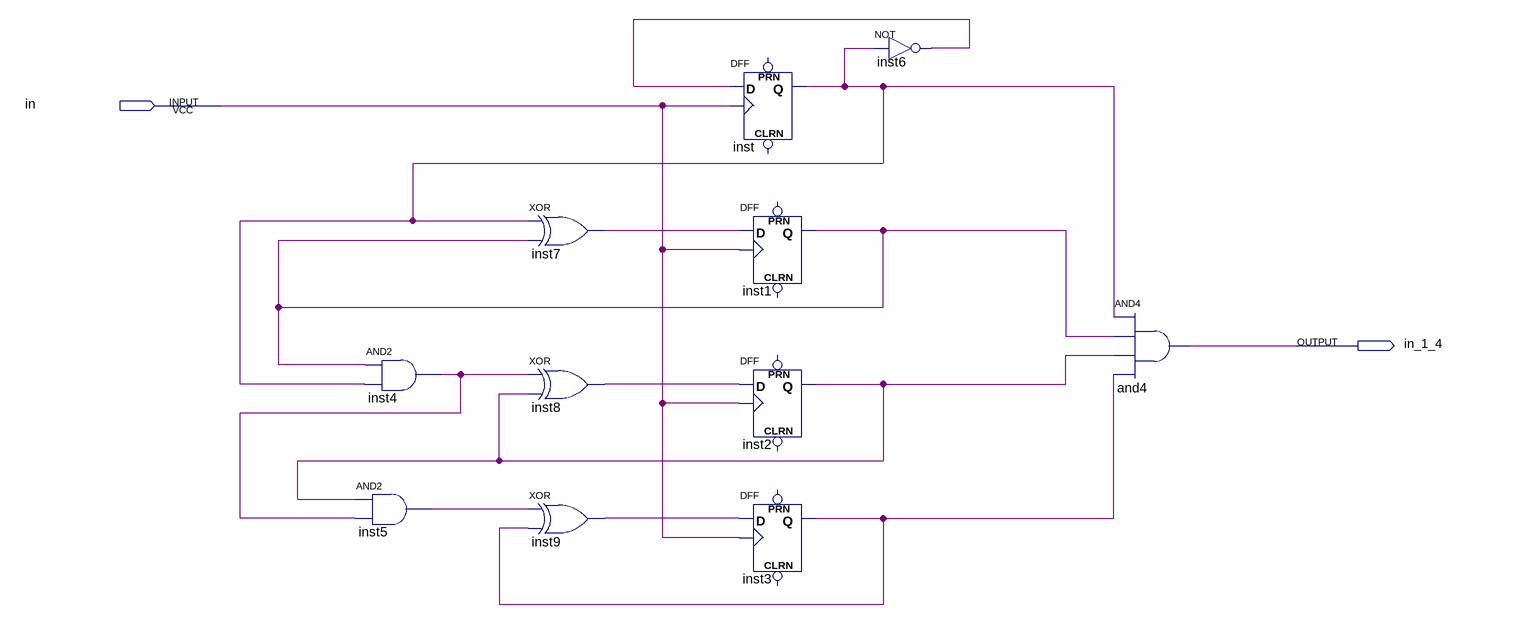
[diagram p0: schematic sheet]
// Quartus schematic in_1_4.bdf as structural Verilog: 11 symbols, 2 pins
module in_1_4 (
  input  in,
  output in_1_4
);

  wire inst1_q, inst2_q, inst3_q, inst4_out, inst5_out, inst6_out, inst7_out, inst8_out, inst9_out, inst_q;

  and inst5 (inst5_out, inst2_q, inst4_out);
  and inst4 (inst4_out, inst1_q, inst_q);
  xor inst7 (inst7_out, inst_q, inst1_q);
  xor inst8 (inst8_out, inst4_out, inst2_q);
  xor inst9 (inst9_out, inst5_out, inst3_q);
  DFF inst (.CLK(in), .D(inst6_out), .Q(inst_q));  // open: CLRN, PRN
  DFF inst1 (.CLK(in), .D(inst7_out), .Q(inst1_q));  // open: CLRN, PRN
  DFF inst2 (.CLK(in), .D(inst8_out), .Q(inst2_q));  // open: CLRN, PRN
  DFF inst3 (.CLK(in), .D(inst9_out), .Q(inst3_q));  // open: CLRN, PRN
  not inst6 (inst6_out, inst_q);
  and and4 (in_1_4, inst_q, inst1_q, inst2_q, inst3_q);
endmodule
